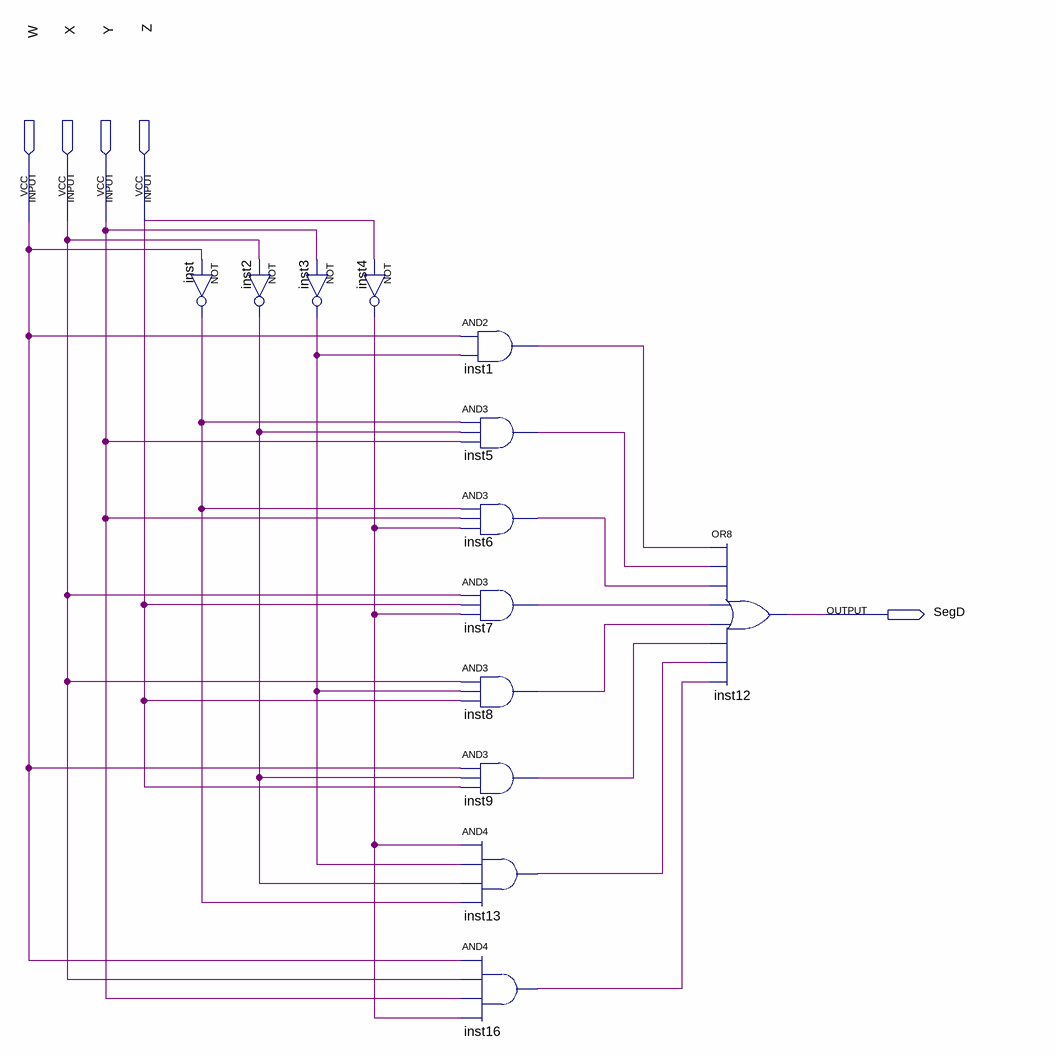
[diagram p0: schematic sheet]
// Quartus schematic SegD.bdf as structural Verilog: 13 symbols, 5 pins
module SegD (
  input  W,
  input  X,
  input  Y,
  input  Z,
  output SegD
);

  wire inst1_out, inst2_out, inst3_out, inst4_out, inst5_out, inst6_out, inst7_out, inst8_out, inst9_out,
       inst13_out, inst16_out, inst_out;

  not inst (inst_out, W);
  not inst2 (inst2_out, X);
  not inst3 (inst3_out, Y);
  not inst4 (inst4_out, Z);
  and inst1 (inst1_out, W, inst3_out);
  and inst5 (inst5_out, inst_out, inst2_out, Y);
  and inst6 (inst6_out, inst_out, Y, inst4_out);
  and inst7 (inst7_out, X, Z, inst4_out);
  and inst8 (inst8_out, X, inst3_out, Z);
  and inst9 (inst9_out, W, inst2_out, Z);
  and inst13 (inst13_out, inst4_out, inst3_out, inst2_out, inst_out);
  and inst16 (inst16_out, W, X, Y, inst4_out);
  or inst12 (SegD, inst1_out, inst5_out, inst6_out, inst7_out, inst8_out, inst9_out, inst13_out, inst16_out);
endmodule
